# Altium schematic sheet CPU.SchDoc
size A3
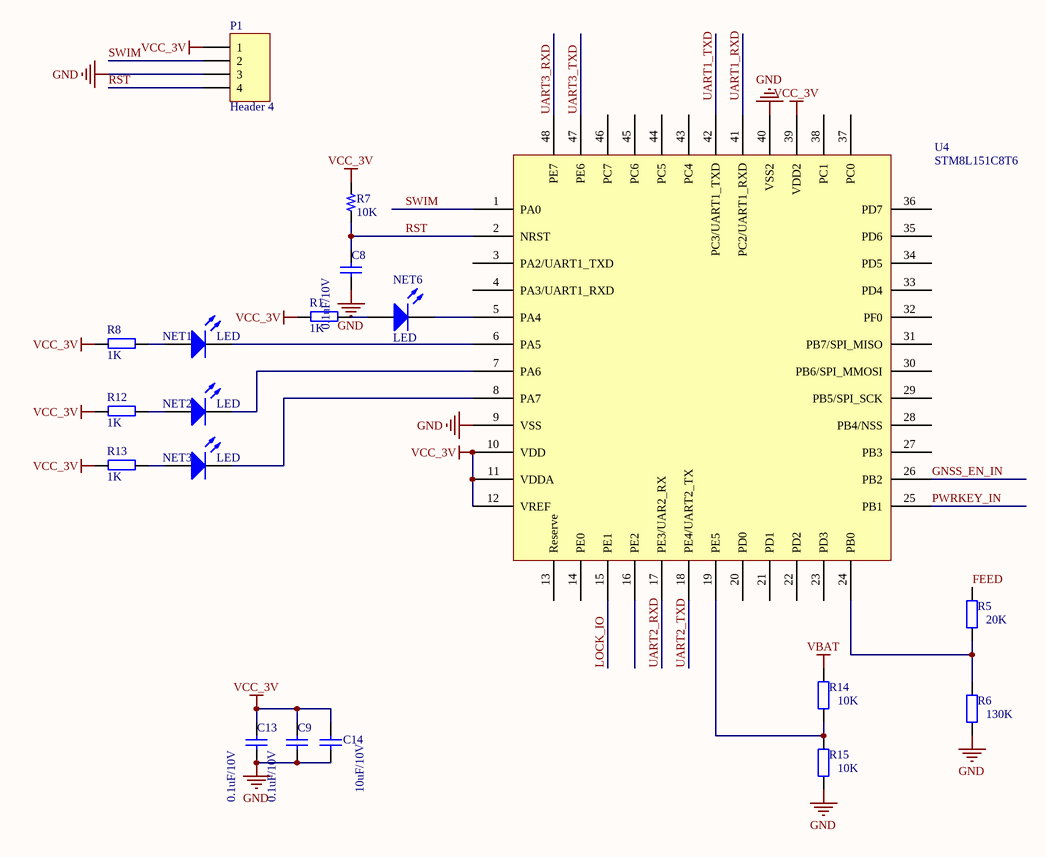
[diagram p0: CPU.SchDoc]

## Parts
C8  0.1uF/10V  [0603C]
C9  0.1uF/10V  [0603C]
C13  0.1uF/10V  [0603C]
C14  10uF/10V  [0603C]
NET1  LED  [0603LED]
NET2  LED  [0603LED]
NET3  LED  [0603LED]
NET6  LED  [0603LED]
P1  Header 4  [HDR1X4]
R1  1K  [0603r]
R5  20K  [0603R]
R6  130K  [0603R]
R7  10K  [0603R]
R8  1K  [0603r]
R12  1K  [0603r]
R13  1K  [0603r]
R14  10K  [0603R]
R15  10K  [0603R]
U4  STM8L151C8T6  [TQFP-48]

## Nets
GND: C8.2 C9.2 C13.2 C14.1 P1.3 R6.2 R15.2 U4.9(VSS) U4.40(VSS2)
VBAT: R14.1
VCC_3V: C9.1 C13.1 C14.2 P1.1 R1.2 R7.2 R8.2 R12.2 R13.2 U4.10(VDD) U4.11(VDDA) U4.12(VREF) U4.39(VDD2)
FEED: R5.1
GNSS_EN_IN: U4.26(PB2)
LOCK_IO: U4.15(PE1)
PWRKEY_IN: U4.25(PB1)
RST: C8.1 P1.4 R7.1 U4.2(NRST)
SWIM: P1.2 U4.1(PA0)
UART1_RXD: U4.41(PC2/UART1_RXD)
UART1_TXD: U4.42(PC3/UART1_TXD)
UART2_RXD: U4.17(PE3/UAR2_RX)
UART2_TXD: U4.18(PE4/UART2_TX)
UART3_RXD: U4.48(PE7)
UART3_TXD: U4.47(PE6)
NetNET1_1: NET1.1(A) R8.1
NetNET1_2: NET1.2(K) U4.6(PA5)
NetNET2_1: NET2.1(A) R12.1
NetNET2_2: NET2.2(K) U4.7(PA6)
NetNET3_1: NET3.1(A) R13.1
NetNET3_2: NET3.2(K) U4.8(PA7)
NetNET6_1: NET6.1(A) R1.1
NetNET6_2: NET6.2(K) U4.5(PA4)
NetR5_2: R5.2 R6.1 U4.24(PB0)
NetR14_2: R14.2 R15.1 U4.19(PE5)

Not connected (* = marked no-connect by the designer): U4 3(PA2/UART1_TXD) 4(PA3/UART1_RXD) 13(Reserve) 14(PE0) 16(PE2) 20(PD0) 21(PD1) 22(PD2) 23(PD3) 27(PB3) 28(PB4/NSS) 29(PB5/SPI_SCK) 30(PB6/SPI_MMOSI) 31(PB7/SPI_MISO) 32(PF0) 33(PD4) 34(PD5) 35(PD6) 36(PD7) 37(PC0) 38(PC1) 43(PC4) 44(PC5) 45(PC6) 46(PC7)

## Library data of the parts
C8 C9 C13 = Cap: Capacitor; Value: 104; Published: 8-Jun-2000; LatestRevisionDate: 17-Jul-2002; LatestRevisionNote: Re-released for DXP Platform.; PackageReference: RAD-0.3; Publisher: Altium Limited
C14 = Cap: Capacitor; Published: 8-Jun-2000; LatestRevisionDate: 17-Jul-2002; LatestRevisionNote: Re-released for DXP Platform.; PackageReference: RAD-0.3; Publisher: Altium Limited; Value: 10uF/10V
NET1-NET3 NET6 = LED2: Typical RED, GREEN, YELLOW, AMBER GaAs LED; Published: 8-Jun-2000; LatestRevisionDate: 17-Jul-2002; LatestRevisionNote: Re-released for DXP Platform.; PackageDocument: Feb-2002; PackageReference: 3.2X1.6X1.1; Publisher: Altium Limited
P1 = Header 4: Header, 4-Pin; LatestRevisionDate: 17-Jul-2002; LatestRevisionNote: Re-released for DXP Platform.; Publisher: Altium Limited
R1 R7 R8 R12 R13 = R
R5 R6 R14 R15 = Res2: Resistor; Value: 0; Published: 8-Jun-2000; LatestRevisionDate: 17-Jul-2002; LatestRevisionNote: Re-released for DXP Platform.; PackageReference: AXIAL-0.4; Publisher: Altium Limited